# Altium project LED_Module.PrjPcb
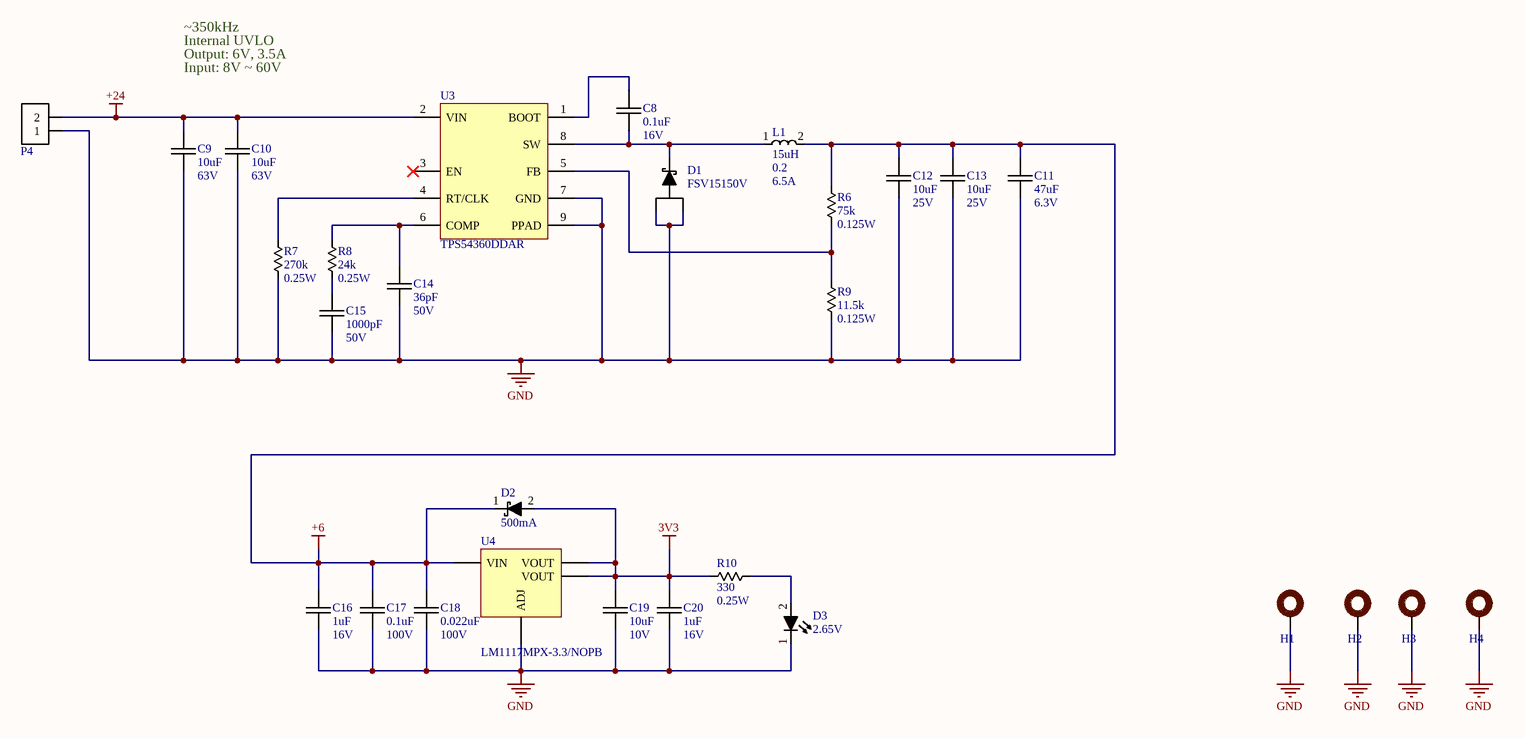
[diagram p0: LedModulePower.SchDoc]
2 sheets, 54 parts. Net scope: global (net labels, ports and power ports of the same name join across sheets).
Board file: LedModulePCB.PcbDoc
Sheets:
  LedModulePower.SchDoc
  LedModuleMicrocontroller.SchDoc

## Sheet LedModulePower.SchDoc
size B

### Parts
C8  Capacitance: 0.1uF  Voltage Rating: 16V  [chip_0603]  (hidden comment: cap_single_np)
C9  Capacitance: 10uF  Voltage Rating: 63V  [chip_1210]  (hidden comment: cap_single_np)
C10  Capacitance: 10uF  Voltage Rating: 63V  [chip_1210]  (hidden comment: cap_single_np)
C11  Capacitance: 47uF  Voltage Rating: 6.3V  [chip_1210]  (hidden comment: cap_single_np)
C12  Capacitance: 10uF  Voltage Rating: 25V  [chip_1206]  (hidden comment: cap_single_np)
C13  Capacitance: 10uF  Voltage Rating: 25V  [chip_1206]  (hidden comment: cap_single_np)
C14  Capacitance: 36pF  Voltage Rating: 50V  [chip_0603]  (hidden comment: cap_single_np)
C15  Capacitance: 1000pF  Voltage Rating: 50V  [chip_0603]  (hidden comment: cap_single_np)
C16  Capacitance: 1uF  Voltage Rating: 16V  [chip_0805]  (hidden comment: cap_single_np)
C17  Capacitance: 0.1uF  Voltage Rating: 100V  [chip_0603]  (hidden comment: cap_single_np)
C18  Capacitance: 0.022uF  Voltage Rating: 100V  [chip_0603]  (hidden comment: cap_single_np)
C19  Capacitance: 10uF  Voltage Rating: 10V  [chip_0805]  (hidden comment: cap_single_np)
C20  Capacitance: 1uF  Voltage Rating: 16V  [chip_0805]  (hidden comment: cap_single_np)
D1  Manufacturer PN: FSV15150V  [TO-277-3]  (hidden comment: diode_sch_A12C3)
D2  Current Rating: 500mA  [sod323_0]  (hidden comment: diode_2)
D3  Forward Voltage: 2.65V  [chip_0603]  (hidden comment: diode_4)
H1  mounting_hole_0  [#8-32_SOCKET_HEAD]  (value not drawn)
H2  mounting_hole_0  [#8-32_SOCKET_HEAD]  (value not drawn)
H3  mounting_hole_0  [#8-32_SOCKET_HEAD]  (value not drawn)
H4  mounting_hole_0  [#8-32_SOCKET_HEAD]  (value not drawn)
L1  Inductance: 15uH  Tolerance: 0.2  Current Rating: 6.5A  [7447709150]  (hidden comment: ind_0)
P4  conn-2x1_0  [TERM_3.50MM_2x1_0]  (value not drawn)
R6  Resistance: 75k  Power Rating: 0.125W  [chip_0805]  (hidden comment: res_single)
R7  Resistance: 270k  Power Rating: 0.25W  [chip_0603]  (hidden comment: res_single)
R8  Resistance: 24k  Power Rating: 0.25W  [chip_0603]  (hidden comment: res_single)
R9  Resistance: 11.5k  Power Rating: 0.125W  [chip_0805]  (hidden comment: res_single)
R10  Resistance: 330  Power Rating: 0.25W  [chip_0603]  (hidden comment: res_single)
U3  Manufacturer PN: TPS54360DDAR  [SO-8_PPAD]  (hidden comment: TPS54360)
U4  Manufacturer PN: LM1117MPX-3.3/NOPB  [sot-223-4]  (hidden comment: LM1117)

### Nets
3V3: C19.1 C20.1 D2.2 R10.1 U4.2(VOUT) U4.4(VOUT)
+6: C11.1 C12.1 C13.1 C16.1 C17.1 C18.1 D2.1 L1.2 R6.1 U4.3(VIN)
+24: C9.1 C10.1 P4.2 U3.2(VIN)
GND: C9.2 C10.2 C11.2 C12.2 C13.2 C14.2 C15.2 C16.2 C17.2 C18.2 C19.2 C20.2 D1.1 D1.2 D3.1 H1.0(A) H2.0(A) H3.0(A) H4.0(A) P4.1 R7.2 R9.2 U3.7(GND) U3.9(PPAD) U4.1(ADJ)
NetC8_1: C8.1 U3.1(BOOT)
NetC8_2: C8.2 D1.3 L1.1 U3.8(SW)
NetC14_1: C14.1 R8.1 U3.6(COMP)
NetC15_1: C15.1 R8.2
NetD3_2: D3.2 R10.2
NetR6_2: R6.2 R9.1 U3.5(FB)
NetR7_1: R7.1 U3.4(RT/CLK)

Not connected (* = marked no-connect by the designer): U3 3(EN)*

### Notes on the sheet
- ~350kHz
- Internal UVLO
- Output: 6V, 3.5A
- Input: 8V ~ 60V

### Library data of the parts
C8 = CAP-00542: CAP, 0.1uF, ±10%, 16V, X7R, 0603; Manufacturer: Murata; Tolerance: ±10%; Part Number: CAP-00542; Type: X7R
C9 C10 = CAP-00554: CAP, 10uF, ±10%, 63V, X7R, 1210; Manufacturer: Samsung Electro-Mechanics; Manufacturer PN: CL32B106KMVNNWE; Tolerance: ±10%; Part Number: CAP-00554; Type: X7R; Cost: 0.81
C11 = CAP-00557: CAP, 47uF, ±20%, 6.3V, X7R, 1210; Manufacturer: KEMET; Manufacturer PN: C1210C476M9RACTU; Tolerance: ±20%; Part Number: CAP-00557; Type: X7R; Cost: $1.08
C12 C13 = CAP-00539: CAP, 10uF, ±10%, 25V, X7R, 1206; Manufacturer: Samsung; Manufacturer PN: CL31B106KAHNNNE; Tolerance: ±10%; Part Number: CAP-00539; Type: X7R
C14 = CAP-00452: CAP, 36pF, ±2%, 50V, C0G, 0603; Manufacturer: Murata; Manufacturer PN: GRM1885C1H360GA01D; Tolerance: ±2%; Part Number: CAP-00452; Type: C0G
C15 = CAP-00465: CAP, 1000pF, ±2%, 50V, C0G, 0603; Manufacturer: Murata; Manufacturer PN: GRM1885C1H102GA01D; Tolerance: ±2%; Part Number: CAP-00465; Type: C0G
C16 C20 = CAP-00107: CAP, 1uF, 10%, 16V, X7R, 0805; Manufacturer: Murata; Manufacturer PN: GRM21BR71C105KA01L; Tolerance: 10%; Part Number: CAP-00107; Type: X7R
C17 = CAP-00530: CAP, 0.1uF, ±10%, 100V, X7R, 0603; Manufacturer: Murata; Manufacturer PN: GRM188R72A104KA35J; Tolerance: ±10%; Part Number: CAP-00530; Type: X7R
C18 = CAP-00524: CAP, 0.022uF, ±10%, 100V, X7R, 0603; Manufacturer: Murata; Manufacturer PN: GRM188R72A223KAC4D; Tolerance: ±10%; Part Number: CAP-00524; Type: X7R
C19 = CAP-00131: CAP, 10uF, 10%, 10V, X7R, 0805; Manufacturer: Murata; Manufacturer PN: GRM21BR71A106KA73L; Tolerance: 10%; Part Number: CAP-00131; Type: X7R
D1 = DIO-00054: Dio, Schottky, 15A, 0.85V, 150V, TO-227; Manufacturer: ON Semi; Current Rating: 15A; Forward Voltage: 0.85V; Type: Schottky; Reverse Breakdown Voltage: 150V; Part Number: DIO-00054; Cost: 0.82
D2 = DIO-00000: Dio Shtky, 500mA, 0.62V, 30V, SOD-323; Manufacturer: ON Semi; Manufacturer PN: NSR0530HT1G; Forward Voltage: 620mV; Type: Schottky; Reverse Breakdown Voltage: 30V; Part Number: DIO-00000
D3 = DIO-00049: LED, Blue, 0603, Low current, HELI2 Series; Manufacturer: Kingbright; Manufacturer PN: APT1608LVBC/D; Reverse Breakdown Voltage: 5V; Current Rating: 30mA; Power Rating: 120mW; Type: LED; Part Number: DIO-00049; Cost: 0.58
H1-H4 = MISC-00027: #8-32 Mounting Hole for Socket Head Cap Screw; Part Number: MISC-00027
L1 = MAG-00090: Ind, 15uH, 0.2, 6.5A, 7447709150; Manufacturer: Wurth; DCR: 26 mOhm; Part Number: MAG-00090; Manufacturer PN: 7447709150; Cost: 2.41
P4 = CONN-00023: Term Blk, 2 Pos, 16A, 3.5mm Pitch; Manufacturer: Phoenix Contact; Manufacturer PN: 1861933; Positions per level: 2; Levels: 1; Current: 16; Part Number: CONN-00023; Type: Terminal Block; Cost: 0.79
R6 = RES-00554: RES SMD 75K OHM 1% 1/8W 0805; Manufacturer: Rohm Semiconductor; Manufacturer PN: KTR10EZPF7502; Tolerance: 1%; Part Number: RES-00554
R7 = RES-00405: RES SMD 270K OHM 1% 1/4W 0603; Manufacturer: Panasonic; Manufacturer PN: ERJ-PA3F2703V; Tolerance: 1%; Part Number: RES-00405
R8 = RES-00399: RES SMD 24K OHM 1% 1/4W 0603; Manufacturer: Panasonic; Manufacturer PN: ERJ-PA3F2402V; Tolerance: 1%; Part Number: RES-00399
R9 = RES-00309: RES SMD 11.5K OHM 1% 1/8W 0805; Manufacturer: Rohm Semiconductor; Manufacturer PN: KTR10EZPF1152; Tolerance: 1%; Part Number: RES-00309
R10 = RES-00221: RES SMD 330 OHM 1% 1/4W 0603; Manufacturer: Panasonic; Manufacturer PN: ERJ-PA3F3300V; Tolerance: 1%; Part Number: RES-00221
U3 = PWREG-00017: REG, SW Buck Adj, 3.5A, 4.5-60V, 2.5MHz; Manufacturer: TI; Voltage Range Out: 0.8 - 58.8V; Max Current: 4.5A; Frequency: 100kHz-2.5MHz; Reg Type: SW Buck; Part Number: PWREG-00017; Voltage Range In: 4.5 - 60V; Fixed/Adj: Adj; Cost: 5.11
U4 = PWREG-00018: REG, Linear, Fixed 3V3, 800mA, SOT-223; Manufacturer: TI; Voltage Range In: 4.5 - 15V; Voltage Range Out: 3.3V; Part Number: PWREG-00018; Max Current: 800mA; Reg Type: Linear; Fixed/Adj: Fixed; Cost: 1.14

## Sheet LedModuleMicrocontroller.SchDoc
size B
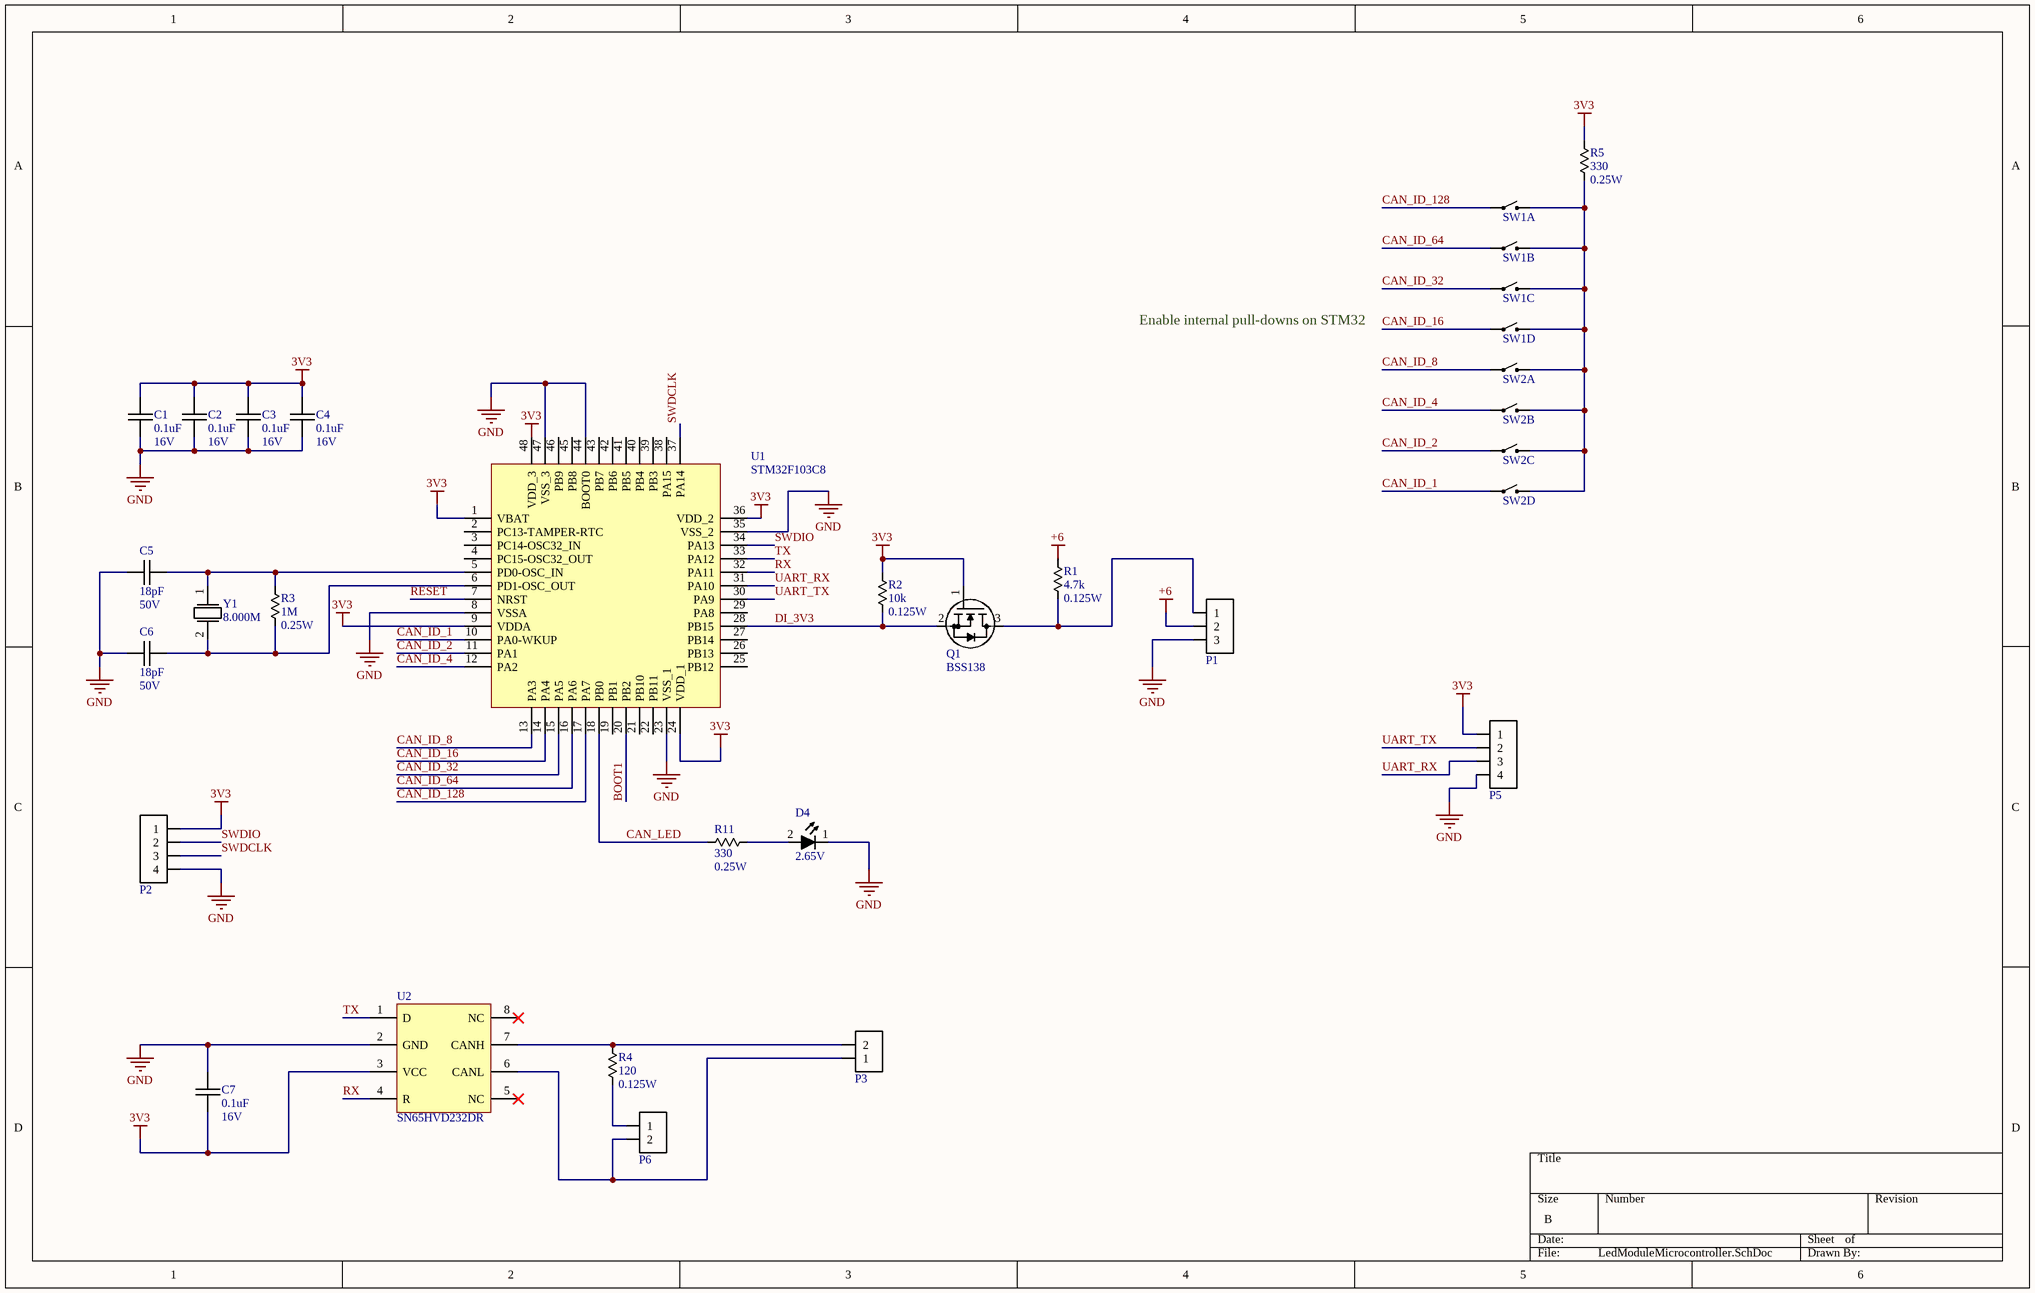
[diagram p1: LedModuleMicrocontroller.SchDoc]

### Parts
C1  Capacitance: 0.1uF  Voltage Rating: 16V  [chip_0603]  (hidden comment: cap_single_np)
C2  Capacitance: 0.1uF  Voltage Rating: 16V  [chip_0603]  (hidden comment: cap_single_np)
C3  Capacitance: 0.1uF  Voltage Rating: 16V  [chip_0603]  (hidden comment: cap_single_np)
C4  Capacitance: 0.1uF  Voltage Rating: 16V  [chip_0603]  (hidden comment: cap_single_np)
C5  Capacitance: 18pF  Voltage Rating: 50V  [chip_0603]  (hidden comment: cap_single_np)
C6  Capacitance: 18pF  Voltage Rating: 50V  [chip_0603]  (hidden comment: cap_single_np)
C7  Capacitance: 0.1uF  Voltage Rating: 16V  [chip_0603]  (hidden comment: cap_single_np)
D4  Forward Voltage: 2.65V  [chip_0603]  (hidden comment: diode_4)
P1  conn-3x1_0  [TERM_3.50MM_3x1_0]  (value not drawn)
P2  conn-4x1_0  [HDDR_4x1_0]  (value not drawn)
P3  conn-2x1_0  [TERM_3.50MM_2x1_0]  (value not drawn)
P5  conn-4x1_0  [HDDR_4x1_0]  (value not drawn)
P6  conn-2x1_0  [hddr_2x1_0]  (value not drawn)
Q1  Manufacturer PN: BSS138  [sot-23-3]  (hidden comment: n-mosfet_1)
R1  Resistance: 4.7k  Power Rating: 0.125W  [chip_0805]  (hidden comment: res_single)
R2  Resistance: 10k  Power Rating: 0.125W  [chip_0805]  (hidden comment: res_single)
R3  Resistance: 1M  Power Rating: 0.25W  [chip_0603]  (hidden comment: res_single)
R4  Resistance: 120  Power Rating: 0.125W  [chip_0805]  (hidden comment: res_single)
R5  Resistance: 330  Power Rating: 0.25W  [chip_0603]  (hidden comment: res_single)
R11  Resistance: 330  Power Rating: 0.25W  [chip_0603]  (hidden comment: res_single)
SW1  DIP_SW_4  [A6S-4104-H]  (value not drawn)  (parts A,B,C,D of 4)
SW2  DIP_SW_4  [A6S-4104-H]  (value not drawn)  (parts A,B,C,D of 4)
U1  STM32F103C8  [LQFP48_0]
U2  Manufacturer PN: SN65HVD232DR  [SO-8]  (hidden comment: SN65HVD232)
Y1  Frequency: 8.000M  [ABLS_AT49_OSC]  (hidden comment: osc_xtal_2p_0)

### Nets
3V3: C1.1 C2.1 C3.1 C4.1 C7.2 P2.1 P5.1 Q1.1(G) R2.1 R5.1 U1.1(VBAT) U1.9(VDDA) U1.24(VDD_1) U1.36(VDD_2) U1.48(VDD_3) U2.3(VCC)
+6: P1.2 R1.1
GND: C1.2 C2.2 C3.2 C4.2 C5.2 C6.1 C7.1 D4.1 P1.3 P2.4 P5.4 U1.8(VSSA) U1.23(VSS_1) U1.35(VSS_2) U1.44(BOOT0) U1.47(VSS_3) U2.2(GND)
BOOT1: U1.20(PB2)
CAN_ID_1: SW2.4 U1.10(PA0-WKUP)
CAN_ID_2: SW2.3 U1.11(PA1)
CAN_ID_4: SW2.2 U1.12(PA2)
CAN_ID_8: SW2.1 U1.13(PA3)
CAN_ID_16: SW1.4 U1.14(PA4)
CAN_ID_32: SW1.3 U1.15(PA5)
CAN_ID_64: SW1.2 U1.16(PA6)
CAN_ID_128: SW1.1 U1.17(PA7)
CAN_LED: R11.2 U1.18(PB0)
DI_3V3: Q1.2(S) R2.2 U1.28(PB15)
RESET: U1.7(NRST)
RX: U1.32(PA11) U2.4(R)
SWDCLK: P2.3 U1.37(PA14)
SWDIO: P2.2 U1.34(PA13)
TX: U1.33(PA12) U2.1(D)
UART_RX: P5.3 U1.31(PA10)
UART_TX: P5.2 U1.30(PA9)
NetC5_1: C5.1 R3.1 U1.5(PD0-OSC_IN) Y1.1
NetC6_2: C6.2 R3.2 U1.6(PD1-OSC_OUT) Y1.2
NetD4_2: D4.2 R11.1
NetP1_1: P1.1 Q1.3(D) R1.2
NetP3_1: P3.1 P6.2 U2.6(CANL)
NetP3_2: P3.2 R4.1 U2.7(CANH)
NetP6_1: P6.1 R4.2
NetR5_2: R5.2 SW1.5 SW1.6 SW1.7 SW1.8 SW2.5 SW2.6 SW2.7 SW2.8

Not connected (* = marked no-connect by the designer): U1 2(PC13-TAMPER-RTC) 3(PC14-OSC32_IN) 4(PC15-OSC32_OUT) 19(PB1) 21(PB10) 22(PB11) 25(PB12) 26(PB13) 27(PB14) 29(PA8) 38(PA15) 39(PB3) 40(PB4) 41(PB5) 42(PB6) 43(PB7) 45(PB8) 46(PB9); U2 5(NC)* 8(NC)*

### Notes on the sheet
- Enable internal pull-downs on STM32

### Library data of the parts
C1-C4 C7 = CAP-00542: as C8 on sheet LedModulePower; Tolerance: ±10%; Part Number: CAP-00542; Type: X7R
C5 C6 = CAP-00409: CAP, 18pF, ±2%, 50V, C0G, 0603; Manufacturer: Murata; Manufacturer PN: GRM1885C1H180GA01D; Tolerance: ±2%; Part Number: CAP-00409; Type: C0G
D4 = DIO-00049: as D3 on sheet LedModulePower; Type: LED; Part Number: DIO-00049; Cost: 0.58
P1 = CONN-00022: Term Blk, 3 Pos, 16A, 3.5mm Pitch; Manufacturer: Phoenix Contact; Manufacturer PN: 1861946; Positions per level: 3; Levels: 1; Current: 16; Part Number: CONN-00022; Type: Terminal Block; Cost: 1.19
P2 P5 = CONN-00029: Header 4x1, 0.1"; Positions per level: 4; Levels: 1; Part Number: CONN-00029; Type: Header
P3 = CONN-00023: as P4 on sheet LedModulePower; Part Number: CONN-00023; Type: Terminal Block; Cost: 0.79
P6 = CONN-00055: Header, 2x1, 0.1"; Manufacturer: Samtec; Manufacturer PN: TSW-102-07-F-S; Positions per level: 2; Levels: 1; Part Number: CONN-00055; Type: Header; Cost: 0.2
Q1 = XSTR-00017: XSTR NMOS, 220mA, 50V, Vgs 1.3V, SOT-23-3; Manufacturer: ON Semi; Max Power: 360mW; Type: NFET; Max Current: 220mA; Max Voltage: 50V; Part Number: XSTR-00017; Vgs/Vce: 1.3V; Cost: 0.31
R1 = RES-00471: RES SMD 4.7K OHM 1% 1/8W 0805; Manufacturer: Rohm Semiconductor; Manufacturer PN: KTR10EZPF4701; Tolerance: 1%; Part Number: RES-00471
R2 = RES-00307: RES SMD 10K OHM 1% 1/8W 0805; Manufacturer: Rohm Semiconductor; Manufacturer PN: KTR10EZPF1002; Tolerance: 1%; Part Number: RES-00307
R3 = RES-00362: RES SMD 1M OHM 1% 1/4W 0603; Manufacturer: Panasonic; Manufacturer PN: ERJ-PA3F1004V; Tolerance: 1%; Part Number: RES-00362
R4 = RES-00183: RES SMD 120 OHM 1% 1/8W 0805; Manufacturer: Rohm Semiconductor; Manufacturer PN: KTR10EZPF1200; Tolerance: 1%; Part Number: RES-00183
R5 R11 = RES-00221: as R10 on sheet LedModulePower; Tolerance: 1%; Part Number: RES-00221
SW1 SW2 = MISC-00026: DIP Switch, SMD, 25mA, 24V; Manufacturer: Omron; Manufacturer PN: A6S-4104-H; Part Number: MISC-00026; Cost: 1.51
U1 = UCTRL-00008: STM32 M3, LQFP-48; Manufacturer: ST; Manufacturer PN: STM32F103C8; Part Number: UCTRL-00008
U2 = IFACE-00008: CANbus Transceiver, Single channel, SN65HVD232; Manufacturer: TI; Part Number: IFACE-00008; Cost: 2.01
Y1 = OSC-00002: XTAL, 8MHz, 18pF, 20ppm; Manufacturer: Abracon; Manufacturer PN: ABLS-8.000MHZ-B2-T; ESR: 80; Stability: 50ppm; Load Capacitance: 18pF; Tolerance: 20ppm; Part Number: OSC-00002

## Nets that join several sheets
3V3: LedModulePower (6 pins), LedModuleMicrocontroller (16 pins)
+6: LedModulePower (10 pins), LedModuleMicrocontroller (P1.2 R1.1)
GND: LedModulePower (25 pins), LedModuleMicrocontroller (17 pins)